# EasyEDA Pro project 自定义控制器主控.eprj

# Schematic Schematic1
Create Date: 2023-11-03; Page Name: P1; Project Name: 自定义控制器主控; Schematic Name: Schematic1; Update Date: 2023-11-04; Company: 嘉立创EDA; Page Size: A4; Version: V1.0
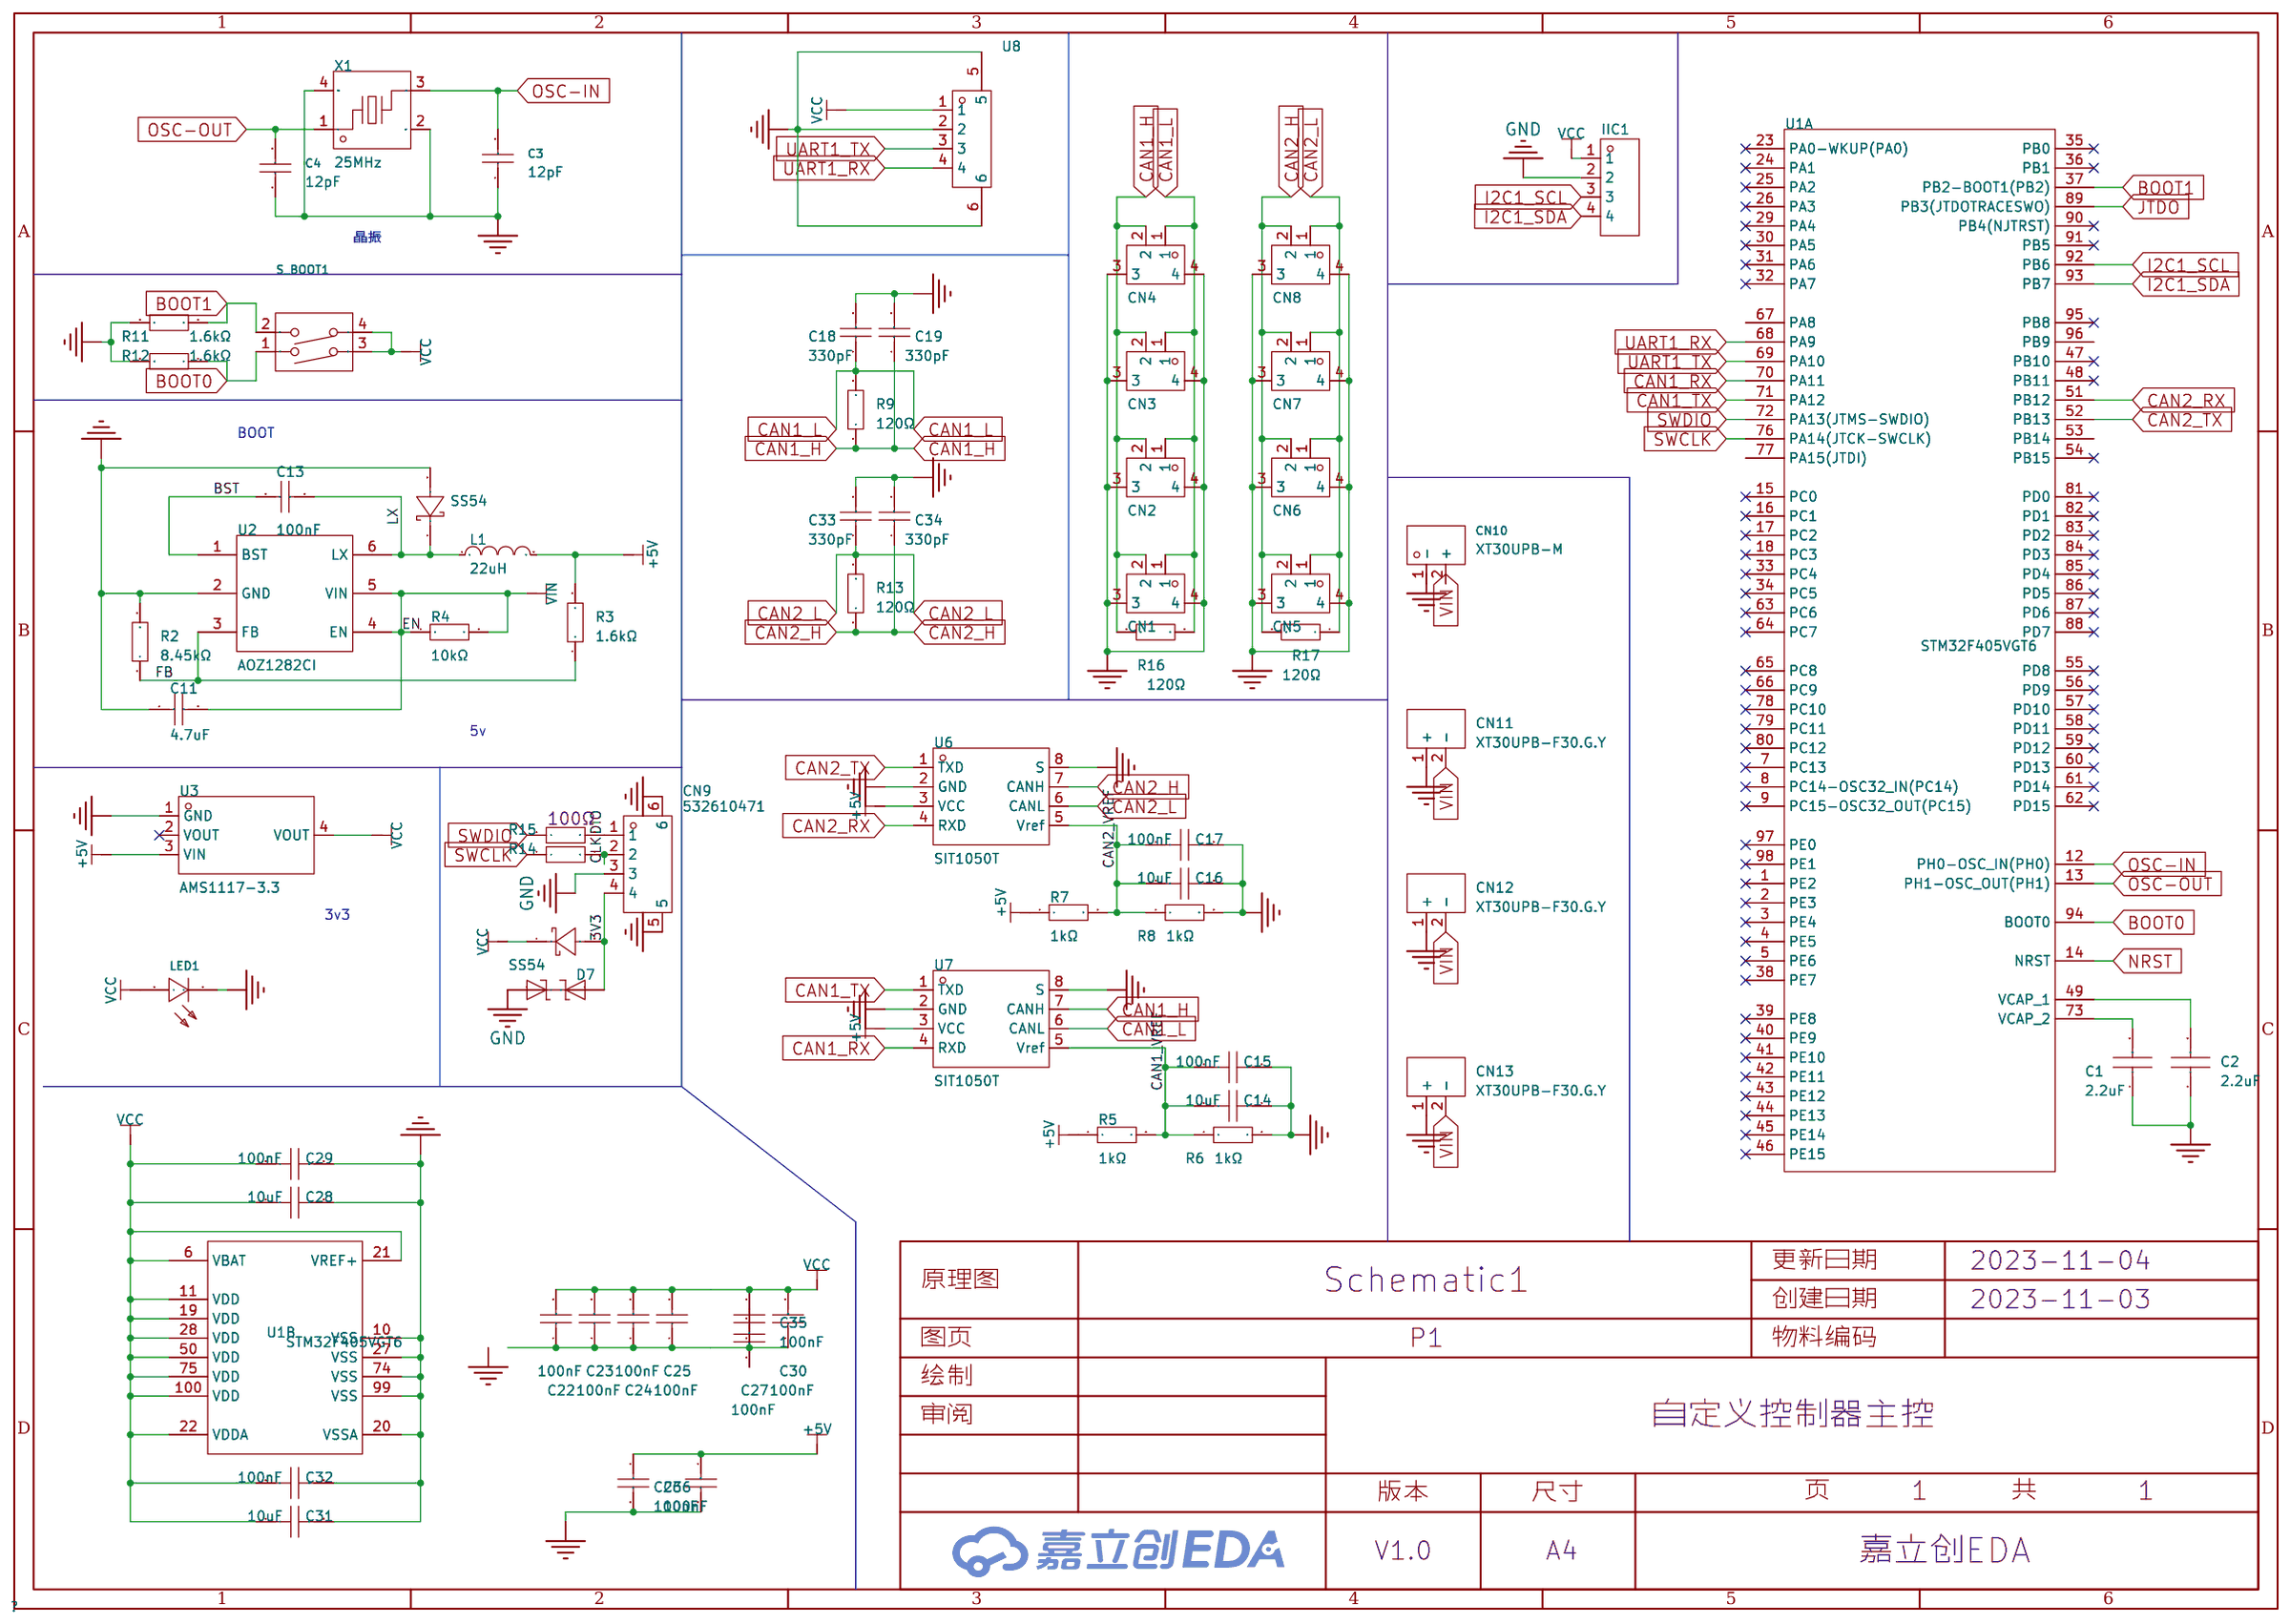
[diagram p0: schematic sheet]

## Parts
C1  2.2uF  [C0402]
C2  2.2uF  [C0402]
C3  12pF  [C0402]
C4  12pF  [C0402]
C11  4.7uF  [C1206]
C13  100nF  [C0603]
C14  10uF  [C0603]
C15  100nF  [C0402]
C16  10uF  [C0603]
C17  100nF  [C0402]
C18  330pF  [C0603]
C19  330pF  [C0603]
C22  100nF  [C0603]
C23  100nF  [C0603]
C24  100nF  [C0603]
C25  100nF  [C0603]
C26  100nF  [C0603]
C27  100nF  [C0603]
C28  10uF  [C0603]
C29  100nF  [C0402]
C30  100nF  [C0603]
C31  10uF  [C0603]
C32  100nF  [C0402]
C33  330pF  [C0603]
C34  330pF  [C0603]
C35  100nF  [C0603]
C36  100nF  [C0603]
CN1  GH1.25-2PWBPZ  [CONN-SMD_GH1.25-2PWBPZ]
CN2  GH1.25-2PWBPZ  [CONN-SMD_GH1.25-2PWBPZ]
CN3  GH1.25-2PWBPZ  [CONN-SMD_GH1.25-2PWBPZ]
CN4  GH1.25-2PWBPZ  [CONN-SMD_GH1.25-2PWBPZ]
CN5  GH1.25-2PWBPZ  [CONN-SMD_GH1.25-2PWBPZ]
CN6  GH1.25-2PWBPZ  [CONN-SMD_GH1.25-2PWBPZ]
CN7  GH1.25-2PWBPZ  [CONN-SMD_GH1.25-2PWBPZ]
CN8  GH1.25-2PWBPZ  [CONN-SMD_GH1.25-2PWBPZ]
CN9  532610471  [CONN-SMD_4P-P1.25_53261-0471]
CN10  XT30UPB-M  [CONN-TH_XT30UPB-M]
CN11  XT30UPB-F30.G.Y  [CONN-TH_XT30UPB-F]
CN12  XT30UPB-F30.G.Y  [CONN-TH_XT30UPB-F]
CN13  XT30UPB-F30.G.Y  [CONN-TH_XT30UPB-F]
D4  SS54  [SMA_L4.3-W2.6-LS5.0-RD]
D7  DW03D-B-S  [SOD-323_L1.7-W1.3-LS2.6-BI]
D8  SS54  [SMA_L4.3-W2.6-LS5.0-RD]
IIC1  2.54-1*4P母  [HDR-TH_4P-P2.54-V-F]
L1  22uH  [IND-SMD_L7.1-W6.6]
LED1  NCD0603R1  [LED0603-RD_RED]
R2  8.45kΩ  [R0603]
R3  1.6kΩ  [R0603]
R4  10kΩ  [R0603]
R5  1kΩ  [R0603]
R6  1kΩ  [R0603]
R7  1kΩ  [R0603]
R8  1kΩ  [R0603]
R9  120Ω  [R0603]
R11  1.6kΩ  [R0603]
R12  1.6kΩ  [R0603]
R13  120Ω  [R0603]
R14  0805W8F1000T5E  [R0805]
R15  0805W8F1000T5E  [R0805]
R16  120Ω  [R0603]
R17  120Ω  [R0603]
S_BOOT1  DSWB02LHGET  [SW-TH_DSWB02LHGET]
U1  STM32F405VGT6  [LQFP-100_L14.0-W14.0-P0.50-LS16.0-BL]  (sections 1,2)
U2  AOZ1282CI  [SOT-23-6_L2.9-W1.6-P0.95-LS2.8-BR]
U3  AMS1117-3.3  [SOT-223-3_L6.5-W3.4-P2.30-LS7.0-BR]
U6  SIT1050T  [SO-8_L4.9-W3.9-P1.27-LS5.9-BL]
U7  SIT1050T  [SO-8_L4.9-W3.9-P1.27-LS5.9-BL]
U8  GH1.25-4PWBPZ  [CONN-SMD_GH1.25-4PWBPZ]
X1  25MHz  [CRYSTAL-SMD_4P-L3.2-W2.5-BL]

## Library data of the parts
C1 C2 = CL05A225MQ5NSNC: 容值:2.2uF;精度:±20%;额定电压:6.3V;材质(温度系数):X5R;; LCSC Part Name: 2.2uF ±20% 6.3V; Supplier Part: C12530; Manufacturer: SAMSUNG(三星); Supplier Footprint: 0402; JLCPCB Part Class: 基础库; Datasheet: https://atta.szlcsc.com/upload/public/pdf/source/20160103/1457707666860.pdf; Supplier: LCSC; Tolerance: ±20%; Voltage Rated: 6.3V; Temperature Coefficient: X5R
C3 C4 = 0402CG120J500NT: 容值:12pF;精度:±5%;额定电压:50V;材质(温度系数):C0G;; LCSC Part Name: 12pF ±5% 50V; Supplier Part: C1547; Manufacturer: FH(风华); Supplier Footprint: 0402; JLCPCB Part Class: 基础库; Datasheet: https://atta.szlcsc.com/upload/public/pdf/source/20200305/C486355_26A10D38EF8C2A5C37091D0039909270.pdf; Supplier: LCSC; Tolerance: ±5%; Voltage Rated: 50V; Temperature Coefficient: C0G
C11 = 1206B475K500NT: 容值:4.7uF;精度:±10%;额定电压:50V;材质(温度系数):X7R;; LCSC Part Name: 4.7uF ±10% 50V; Supplier Part: C29823; Manufacturer: FH(风华); Supplier Footprint: 1206; JLCPCB Part Class: 基础库; Datasheet: https://atta.szlcsc.com/upload/public/pdf/source/20170923/C29823_1506149432461988716.pdf; Supplier: LCSC; Tolerance: ±10%; Voltage Rated: 50V; Temperature Coefficient: X7R
C13 C22-C27 C30 C35 C36 = 0603B104K500NT: 容值:100nF;精度:±10%;额定电压:50V;材质(温度系数):X7R;; LCSC Part Name: 100nF ±10% 50V; Supplier Part: C30926; Manufacturer: FH(风华); Supplier Footprint: 0603; JLCPCB Part Class: 扩展库; Datasheet: https://atta.szlcsc.com/upload/public/pdf/source/20170923/C30926_1506149436298988724.pdf; Supplier: LCSC; Tolerance: ±10%; Voltage Rated: 50V; Temperature Coefficient: X7R
C14 C16 C28 C31 = CL10A106KP8NNNC: 容值:10uF;精度:±10%;额定电压:10V;材质(温度系数):X5R;; LCSC Part Name: 10uF ±10% 10V; Supplier Part: C19702; Manufacturer: SAMSUNG(三星); Supplier Footprint: 0603; JLCPCB Part Class: 基础库; Datasheet: https://atta.szlcsc.com/upload/public/pdf/source/20160103/1457707703378.pdf; Supplier: LCSC; Tolerance: ±10%; Voltage Rated: 10V; Temperature Coefficient: X5R
C15 C17 C29 C32 = CC0402KRX7R7BB104: 容值:100nF;精度:±10%;额定电压:16V;材质(温度系数):X7R;; LCSC Part Name: 100nF ±10% 16V; Supplier Part: C60474; Manufacturer: YAGEO(国巨); Supplier Footprint: 0402; JLCPCB Part Class: 扩展库; Datasheet: https://atta.szlcsc.com/upload/public/pdf/source/20211223/9278FD768280B81DDBEF48FA36411A03.pdf; Supplier: LCSC; Tolerance: ±10%; Voltage Rated: 16V; Temperature Coefficient: X7R
C18 C19 C33 C34 = 0603B331K500NT: 容值:330pF;精度:±10%;额定电压:50V;材质(温度系数):X7R;; LCSC Part Name: 330pF ±10% 50V; Supplier Part: C1612; Manufacturer: FH(风华); Supplier Footprint: 0603; JLCPCB Part Class: 扩展库; Datasheet: https://atta.szlcsc.com/upload/public/pdf/source/20170923/C1612_1506149292351988411.pdf; Supplier: LCSC; Tolerance: ±10%; Voltage Rated: 50V; Temperature Coefficient: X7R
CN1-CN8 = GH1.25-2PWBPZ: LCSC Part Name: GH1.25-2P卧贴编带; Supplier Part: C2829251; Manufacturer: BOOMELE(博穆精密); JLCPCB Part Class: 扩展库; Datasheet: https://atta.szlcsc.com/upload/public/pdf/source/20211125/08A09A4909F58AF780B71FE423A00F7E.pdf; Supplier: LCSC
CN9 = 532610471: 参考系列:-;间距:1.25mm;插针结构:1x4P;排数:1;每排PIN数:4;行距:-;安装方式:-;触头材质:青铜;; LCSC Part Name: 间距:1.25mm 1x4P; Supplier Part: C240847; Manufacturer: MOLEX; Supplier Footprint: SMD,P=1.25mm; JLCPCB Part Class: 扩展库; Datasheet: https://atta.szlcsc.com/upload/public/pdf/source/20180801/C240848_05185111BCEC053393D7785380F62CFD.pdf; Supplier: LCSC; Pitch: 1.25mm; Pins Structure: 1x4P; Number of Rows: 1; Number of PINs Per Row: 4; Contact Material: 青铜
CN10 = XT30UPB-M: 类别:-;类型1:-;; LCSC Part Name: AMASS(艾迈斯)板载立式 航模锂电池控制器连接器插头 公头XT30UPB-M; Supplier Part: C428721; Manufacturer: AMASS(艾迈斯); JLCPCB Part Class: 扩展库; Datasheet: https://atta.szlcsc.com/upload/public/pdf/source/20230412/7B5DFEF57C9EA5273853390C734B3AC5.pdf; Supplier: LCSC; Brand: 艾迈斯; Type: 航模插头; Colour: 黄色; RatedVoltage: DC 500V; InterfaceType: 公头; MetalMaterial: 镀金; InsulationMaterial: PA; RatedCurrent: 15A; contact resistance: 0.65mΩ
CN11-CN13 = XT30UPB-F30.G.Y: 模型插头连接器; LCSC Part Name: AMASS(艾迈斯)直立焊板式连接器XT30UPB30-F.G.*; Supplier Part: C108769; Manufacturer: AMASS(艾迈斯); JLCPCB Part Class: 扩展库; Datasheet: https://atta.szlcsc.com/upload/public/pdf/source/20220715/AFD68B9E8B6CA95A7295DBF4AF9325E4.pdf; Supplier: LCSC
D4 D8 = SS54_C727065: 二极管配置:独立式;直流反向耐压(Vr):40V;平均整流电流(Io):5A;正向压降(Vf):550mV@5A;反向电流(Ir):500A@40V;; LCSC Part Name: 40V 5A 550mV@5A; Supplier Part: C727065; Manufacturer: TWGMC(台湾迪嘉); Supplier Footprint: SMA; JLCPCB Part Class: Extended Part; Datasheet: https://atta.szlcsc.com/upload/public/pdf/source/20200828/C727064_BD0A2B36CBC76CEA4B6710C57718D41F.pdf; Supplier: LCSC; Diode Configuration: 独立式; Reverse Voltage (Vr): 40V; Average Rectified Current (Io): 5A; Forward Voltage (Vf@If): 550mV@5A; Reverse Leakage Current (Ir): 500A@40V
D7 = DW03D-B-S: 极性:双向;反向截止电压(Vrwm):3.3V@Max;击穿电压(最小值):4V;击穿电压(最大值):-;反向漏电流(Ir):200nA;峰值脉冲电流(Ipp)@10/1000s:30A@8/20s;最大钳位电压:15V;峰值脉冲功率(Ppp)@10/1000s:450W@8/20s;; LCSC Part Name: 双向 Vrwm：3.3V@Max 450W@8/20s; Supplier Part: C2985478; Manufacturer: DOWO(东沃); Supplier Footprint: SOD-323; JLCPCB Part Class: Extended Part; Datasheet: https://atta.szlcsc.com/upload/public/pdf/source/20220323/2C0F61FEADD933F2ABF7337BEDBCF2BE.pdf; Supplier: LCSC; Polarity: 双向; Reverse Stand-Off Voltage (Vrwm): 3.3V@Max; Breakdown Voltage (Min): 4V; Reverse Leakage Current (Ir): 200nA; Peak Pulse Current (Ipp)@10/1000μs: 30A@8/20s; Maximum Clamping Voltage: 15V; Peak Pulse Power Dissipation (Ppp)@10/1000μs: 450W@8/20s
IIC1 = 2.54-1*4P母: 间距:2.54mm;总孔位数:4;排数:1;插孔结构:1x4P;行距:-;安装类型:直插;圆孔/方孔:方孔;额定电流:3A;额定电压:-;插孔方向:顶部;塑高:-;触头材质:青铜;触头镀层:-;工作温度范围:-40~+105;焊接温度(最大值):-;; LCSC Part Name: 2.54mm 1x4P; Supplier Part: C2718488; Manufacturer: BOOMELE(博穆精密); Supplier Footprint: 直插,P=2.54mm; JLCPCB Part Class: Extended Part; Datasheet: https://atta.szlcsc.com/upload/public/pdf/source/20210301/C2718488_F4427B881E42CAA8DDB0B1C12B3A522C.pdf; Supplier: LCSC; Pitch: 2.54mm; Number of Holes: 4; Number of Rows: 1; Holes Structure: 1x4P; Mounting Type: 直插; Circular Hole / Square Hole: 方孔; Current Rating (Max): 3A; Holes Direction: 顶部; Contact Material: 青铜; Operating Temperature Range: -40~+105
L1 = SLO0630H220MTT: 电感值:22uH;精度:±20%;额定电流:-;; LCSC Part Name: 22uH ±20%; Supplier Part: C207843; Manufacturer: Sunltech(韩国顺磁); Supplier Footprint: SMD; JLCPCB Part Class: 扩展库; Datasheet: https://atta.szlcsc.com/upload/public/pdf/source/20190925/C207843_2DF3589AE4B4D36C0A2894A292E80B76.pdf; Supplier: LCSC; Tolerance: ±20%
LED1 = NCD0603R1_C84263: 发光颜色:红灯;; LCSC Part Name: 红灯 0603红灯   正贴; Supplier Part: C84263; Manufacturer: 国星光电; Supplier Footprint: 0603; JLCPCB Part Class: 扩展库; Datasheet: https://atta.szlcsc.com/upload/public/pdf/source/20200820/C84263_DABC6A75E58F576973B407FDBA283D60.pdf; Supplier: LCSC; Emitted Color: 红灯
R2 = RMC06038.45K1%N: 阻值:8.45kΩ;精度:±1%;功率:100mW;; LCSC Part Name: 8.45kΩ ±1% 100mW; Supplier Part: C269431; Manufacturer: Tyohm(幸亚电阻); Supplier Footprint: 0603; JLCPCB Part Class: 扩展库; Datasheet: https://atta.szlcsc.com/upload/public/pdf/source/20190115/C269431_F17446403FF160758889B3EFAC3153F3.pdf; Supplier: LCSC; Tolerance: ±1%; Power(Watts): 100mW
R3 R11 R12 = 0603WAF1601T5E: 电阻类型:厚膜电阻;阻值:1.6kΩ;精度:±1%;功率:100mW;温度系数:±100ppm/℃;; LCSC Part Name: 厚膜电阻 1.6kΩ ±1% 100mW; Supplier Part: C22847; Manufacturer: UNI-ROYAL(厚声); Supplier Footprint: 0603; JLCPCB Part Class: Extended Part; Datasheet: https://atta.szlcsc.com/upload/public/pdf/source/20200306/C422600_1E6D84923E4A46A82E41ADD87F860B5C.pdf; Supplier: LCSC; Type: 厚膜电阻; Tolerance: ±1%; Power(Watts): 100mW; Temperature Coefficient: ±100ppm/℃; Overload Voltage (Max): 75V; Operating Temperature Range: -55℃~+155℃
R4 = 0603WAF1002T5E: 电阻类型:厚膜电阻;阻值:10kΩ;精度:±1%;功率:100mW;; LCSC Part Name: 厚膜电阻 10kΩ ±1% 100mW; Supplier Part: C25804; Manufacturer: UNI-ROYAL(厚声); Supplier Footprint: 0603; JLCPCB Part Class: Basic Part; Datasheet: https://atta.szlcsc.com/upload/public/pdf/source/20200306/C422600_1E6D84923E4A46A82E41ADD87F860B5C.pdf; Supplier: LCSC; Type: 厚膜电阻; Tolerance: ±1%; Power(Watts): 100mW; Temperature Coefficient: ±100ppm/℃; Overload Voltage (Max): 75V; Operating Temperature Range: -55℃~+155℃
R5-R8 = 0603WAF1001T5E: 电阻类型:厚膜电阻;阻值:1kΩ;精度:±1%;功率:100mW;温度系数:±100ppm/℃;; LCSC Part Name: 厚膜电阻 1kΩ ±1% 100mW; Supplier Part: C21190; Manufacturer: UNI-ROYAL(厚声); Supplier Footprint: 0603; JLCPCB Part Class: Basic Part; Datasheet: https://atta.szlcsc.com/upload/public/pdf/source/20200306/C422600_1E6D84923E4A46A82E41ADD87F860B5C.pdf; Supplier: LCSC; Type: 厚膜电阻; Tolerance: ±1%; Power(Watts): 100mW; Temperature Coefficient: ±100ppm/℃; Overload Voltage (Max): 75V; Operating Temperature Range: -55℃~+155℃
R9 R13 R16 R17 = 0603WAF1200T5E: 电阻类型:厚膜电阻;阻值:120Ω;精度:±1%;功率:100mW;温度系数:±100ppm/℃;; LCSC Part Name: 厚膜电阻 120Ω ±1% 100mW; Supplier Part: C22787; Manufacturer: UNI-ROYAL(厚声); Supplier Footprint: 0603; JLCPCB Part Class: Basic Part; Datasheet: https://atta.szlcsc.com/upload/public/pdf/source/20200306/C422600_1E6D84923E4A46A82E41ADD87F860B5C.pdf; Supplier: LCSC; Type: 厚膜电阻; Tolerance: ±1%; Power(Watts): 100mW; Temperature Coefficient: ±100ppm/℃; Overload Voltage (Max): 75V; Operating Temperature Range: -55℃~+155℃
R14 = 0805W8F1000T5E: LCSC Part Name: 100Ω(1000) ±1% 编带; Supplier Part: C17408; Manufacturer: UNI-ROYAL(厚声); Supplier Footprint: 0805; JLCPCB Part Class: Basic Part; Datasheet: https://atta.szlcsc.com/upload/public/pdf/source/20170920/C17408_1505887063818979767.pdf; Supplier: LCSC
R15 = 0805W8F1000T5E: LCSC Part Name: 100Ω; Supplier Part: C17408; Manufacturer: UNI-ROYAL(厚声); Supplier Footprint: 0805; JLCPCB Part Class: Basic Part; Datasheet: https://atta.szlcsc.com/upload/public/pdf/source/20170920/C17408_1505887063818979767.pdf; Supplier: LCSC
S_BOOT1 = DSWB02LHGET: 类型:平拨,凸起式;电路结构:单刀单掷;开关位数:2;使用寿命:-;颜色:红色;; LCSC Part Name: 拨码开关,平拨开关,DSWB02LHGET; Supplier Part: C99421; Manufacturer: YE; Supplier Footprint: 插件; JLCPCB Part Class: 扩展库; Datasheet: https://atta.szlcsc.com/upload/public/pdf/source/20170330/1490854270511.pdf; Supplier: LCSC; Type: 平拨,凸起式; Circuit: 单刀单掷; Number of Positions: 2; Lead Pitch: 2.54mm; Color: 红色
U1 = STM32F405VGT6: CPU内核:ARM Cortex-M4;CPU最大主频:168MHz;工作电压范围:1.8V~3.6V;程序存储容量:1MB;程序存储器类型:FLASH;RAM总容量:192KB;GPIO端口数量:82;; Supplier Part: C56621; Manufacturer: ST(意法半导体); Supplier Footprint: LQFP-100(14x14); JLCPCB Part Class: 扩展库; Datasheet: https://atta.szlcsc.com/upload/public/pdf/source/20150910/1457707351424.pdf; Supplier: LCSC; CPU Core: ARM Cortex-M4; CPU Maximum Speed: 168MHz; Operating Voltage Range: 1.8V~3.6V; Program Storage Size: 1MB; Program Memory Type: FLASH; RAM Size: 192KB; GPIO Ports Number: 82; ADC (Bit): 12bit; DAC (Bit): 12bit; Universal Serial Bus: 有; Peripheral/Function: DMA；LCD/LED驱动；PWM; Watchdog: 有; Infrared Data Association: 有; Low-Voltage Detect: 有; LCD Module: 有; Direct Memory Access: 有; Internal Oscillator: 有; Operating Temperature Range: -40℃~+85℃
U2 = AOZ1282CI: 功能类型:降压型;输出类型:可调;输入电压:4.5V~36V;输出电压:800mV~36V;输出电流(最大值):1.2A;; LCSC Part Name: 降压型 输入4.5V~36V 输出800mV~36V 1.2A; Supplier Part: C111916; Manufacturer: AOS; Supplier Footprint: SOT-23-6; JLCPCB Part Class: 扩展库; Datasheet: https://atta.szlcsc.com/upload/public/pdf/source/20170620/1497944735320.pdf; Supplier: LCSC; Function: 降压型; Synchronous Rectification: 否; Output Type: 可调; Number of Outputs: 1; Topology: 降压式; Input Voltage: 4.5V~36V; Output Voltage: 800mV~36V; Output Current (Max): 1.2A; Switching Frequency: 450kHz; Operating Temperature: -40℃~+85℃@(TA)
U3 = AMS1117-3.3_C6186: 输出类型:固定;输出极性:正;最大输入电压:-;输出电压:3.3V;输出电流:1A;电源纹波抑制比(PSRR):72dB@(120Hz);; LCSC Part Name: 输出3.3V 1A; Supplier Part: C6186; Manufacturer: AMS; Supplier Footprint: SOT-223; JLCPCB Part Class: 基础库; Datasheet: https://atta.szlcsc.com/upload/public/pdf/source/20180727/C6186_7A095716F0823C02F1997A905E26C086.pdf; Supplier: LCSC; Output Type: 固定; Output Polarity: 正; Number of Outputs: 1; Output Voltage: 3.3V; Dropout Voltage: 1.3V@(800mA); Output Current: 1A; Power Supply Rejection Ratio (PSRR): 72dB@(120Hz)
U6 U7 = SIT1050T: 类型:收发器;数据速率:1Mbps;; Supplier Part: C313021; Manufacturer: SIT(芯力特); Supplier Footprint: SO-8; JLCPCB Part Class: 扩展库; Datasheet: https://atta.szlcsc.com/upload/public/pdf/source/20190522/C313021_F295A63AE262020D1D58DBA99C3629E3.pdf; Supplier: LCSC; Type: 收发器; Data Rate: 1Mbps; Supply Voltage: 4.5V~5.5V
U8 = GH1.25-4PWBPZ: LCSC Part Name: GH1.25-4P卧贴编带; Supplier Part: C2829253; Manufacturer: BOOMELE(博穆精密); JLCPCB Part Class: 扩展库; Datasheet: https://atta.szlcsc.com/upload/public/pdf/source/20211125/08A09A4909F58AF780B71FE423A00F7E.pdf; Supplier: LCSC
X1 = XL2EL89CSI-111YLC-25M: 频率:25MHz;频率公差:±10ppm;负载电容:20pF;; LCSC Part Name: 25MHz ±10ppm 20pF YSX321SL; Supplier Part: C5280577; Manufacturer: YXC(扬兴晶振); Supplier Footprint: SMD3225-4P; JLCPCB Part Class: 扩展库; Datasheet: https://atta.szlcsc.com/upload/public/pdf/source/20221123/8DAA01809C4E3F159850A71277C18D74.pdf; Supplier: LCSC; Crystal Type: 贴片无源晶振; Frequency Tolerance: ±10ppm; Load Capacitance: 20pF

## Nets
3V3: CN9.4 D4.2 D7.2(A)
+5V: C26.1 C36.1 L1.2 R3.2 R5.1 R7.1 U3.3(VIN) U6.3(VCC) U7.3(VCC)
GND: C1.1 C2.1 C3.1 C4.1 C11.1 C14.2 C15.2 C16.2 C17.2 C18.2 C19.2 C22.1 C23.1 C24.1 C25.1 C26.2 C27.1 C28.2 C29.2 C30.1 C31.2 C32.2 C33.2 C34.2 C35.2 C36.2 CN1.3 CN1.4 CN2.3 CN2.4 CN3.3 CN3.4 CN4.3 CN4.4 CN5.3 CN5.4 CN6.3 CN6.4 CN7.3 CN7.4 CN8.3 CN8.4 CN9.3 CN9.5 CN9.6 CN10.1(-) CN11.1(+) CN12.1(+) CN13.1(+) D7.1(K) D8.2 IIC1.2 LED1.1(K) R2.2 R6.2 R8.2 R11.2 R12.2 U1.10(VSS) U1.20(VSSA) U1.27(VSS) U1.74(VSS) U1.99(VSS) U2.2(GND) U3.1(GND) U6.2(GND) U6.8(S) U7.2(GND) U7.8(S) U8.2 U8.5 U8.6 X1.2(GND) X1.4(GND)
VCC: C22.2 C23.2 C24.2 C25.2 C27.2 C28.1 C29.1 C30.2 C31.1 C32.1 C35.1 D4.1 IIC1.1 LED1.2(A) S_BOOT1.3 S_BOOT1.4 U1.6(VBAT) U1.11(VDD) U1.19(VDD) U1.21(VREF+) U1.22(VDDA) U1.28(VDD) U1.50(VDD) U1.75(VDD) U1.100(VDD) U3.4(VOUT) U8.1
VIN: C11.2 CN10.2(+) CN11.2(-) CN12.2(-) CN13.2(-) R4.2 U2.5(VIN)
BOOT0: R12.1 S_BOOT1.1 U1.94(BOOT0)
BOOT1: R11.1 S_BOOT1.2 U1.37(PB2-BOOT1(PB2))
BST: C13.1 U2.1(BST)
CAN1_H: C19.1 CN1.2 CN2.2 CN3.2 CN4.2 R9.1 R16.2 U7.7(CANH)
CAN1_L: C18.1 CN1.1 CN2.1 CN3.1 CN4.1 R9.2 R16.1 U7.6(CANL)
CAN1_RX: U1.70(PA11) U7.4(RXD)
CAN1_TX: U1.71(PA12) U7.1(TXD)
CAN1_VREF: C14.1 C15.1 R5.2 R6.1 U7.5(Vref)
CAN2_H: C34.1 CN5.2 CN6.2 CN7.2 CN8.2 R13.1 R17.2 U6.7(CANH)
CAN2_L: C33.1 CN5.1 CN6.1 CN7.1 CN8.1 R13.2 R17.1 U6.6(CANL)
CAN2_RX: U1.51(PB12) U6.4(RXD)
CAN2_TX: U1.52(PB13) U6.1(TXD)
CAN2_VREF: C16.1 C17.1 R7.2 R8.1 U6.5(Vref)
CLK: CN9.2 R14.2
DIO: CN9.1 R15.2
EN: R4.1 U2.4(EN)
FB: R2.1 R3.1 U2.3(FB)
I2C1_SCL: IIC1.3 U1.92(PB6)
I2C1_SDA: IIC1.4 U1.93(PB7)
JTDO: U1.89(PB3(JTDOTRACESWO))
LX: C13.2 D8.1 L1.1 U2.6(LX)
NRST: U1.14(NRST)
OSC-IN: C3.2 U1.12(PH0-OSC_IN(PH0)) X1.3
OSC-OUT: C4.2 U1.13(PH1-OSC_OUT(PH1)) X1.1
SWCLK: R14.1 U1.76(PA14(JTCK-SWCLK))
SWDIO: R15.1 U1.72(PA13(JTMS-SWDIO))
UART1_RX: U1.68(PA9) U8.4
UART1_TX: U1.69(PA10) U8.3
VCAP_1: C2.2 U1.49(VCAP_1)
VCAP_2: C1.2 U1.73(VCAP_2)

Not connected (* = marked no-connect by the designer): U1 1(PE2)* 2(PE3)* 3(PE4)* 4(PE5)* 5(PE6)* 7(PC13)* 8(PC14-OSC32_IN(PC14))* 9(PC15-OSC32_OUT(PC15))* 15(PC0)* 16(PC1)* 17(PC2)* 18(PC3)* 23(PA0-WKUP(PA0))* 24(PA1)* 25(PA2)* 26(PA3)* 29(PA4)* 30(PA5)* 31(PA6)* 32(PA7)* 33(PC4)* 34(PC5)* 35(PB0)* 36(PB1)* 38(PE7)* 39(PE8)* 40(PE9)* 41(PE10)* 42(PE11)* 43(PE12)* 44(PE13)* 45(PE14)* 46(PE15)* 47(PB10)* 48(PB11)* 53(PB14) 54(PB15)* 55(PD8)* 56(PD9)* 57(PD10)* 58(PD11)* 59(PD12)* 60(PD13)* 61(PD14)* 62(PD15)* 63(PC6)* 64(PC7)* 65(PC8)* 66(PC9)* 67(PA8) 77(PA15(JTDI)) 78(PC10)* 79(PC11)* 80(PC12)* 81(PD0)* 82(PD1)* 83(PD2)* 84(PD3)* 85(PD4)* 86(PD5)* 87(PD6)* 88(PD7)* 90(PB4(NJTRST))* 91(PB5)* 95(PB8)* 96(PB9) 97(PE0)* 98(PE1)*; U3 2(VOUT)*

## Notes on the sheet
- 晶振
- BOOT
- 5v
- 3v3

# Board PCB1
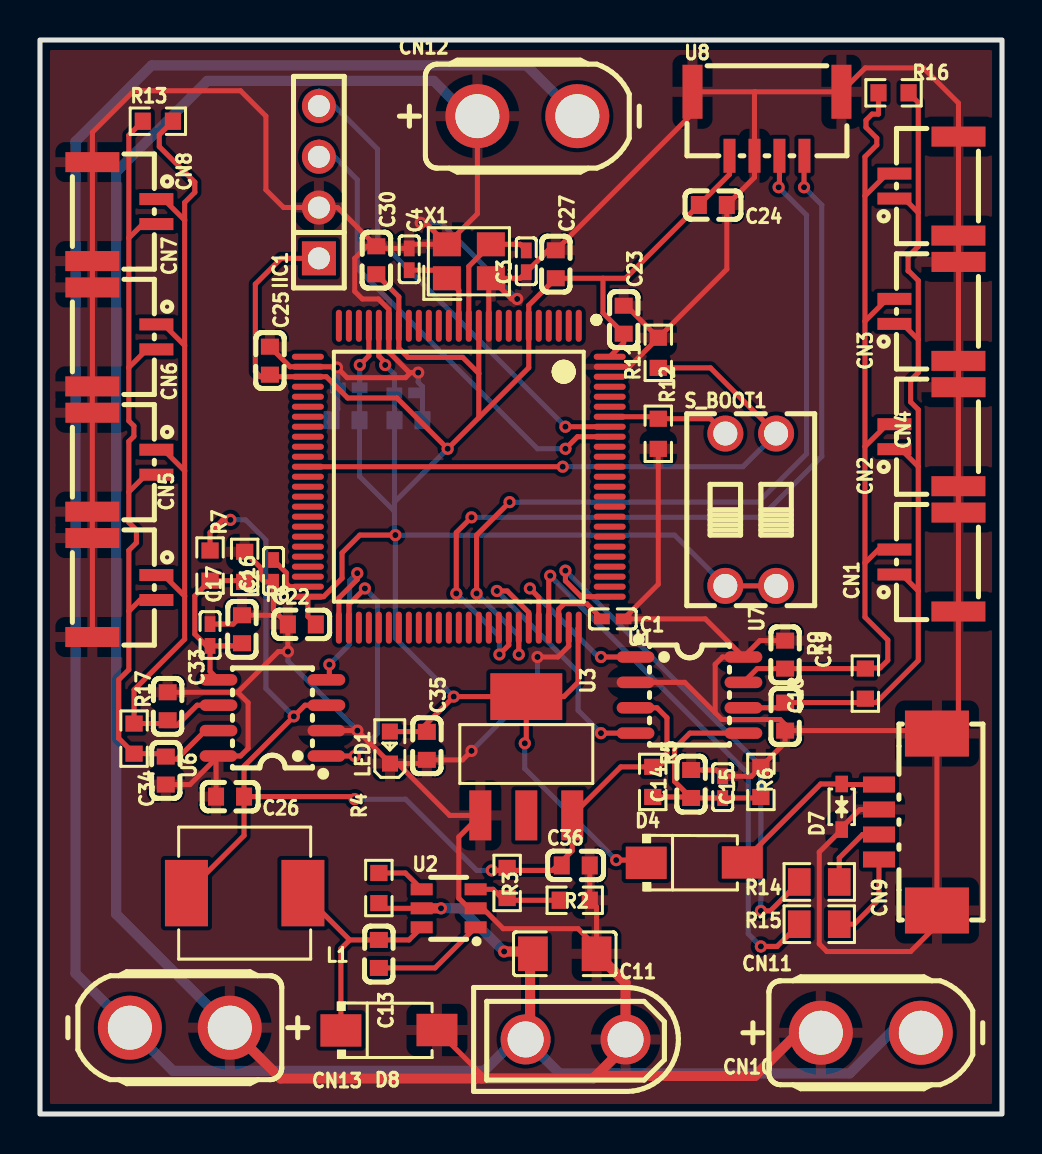
[diagram p1: board, top side]
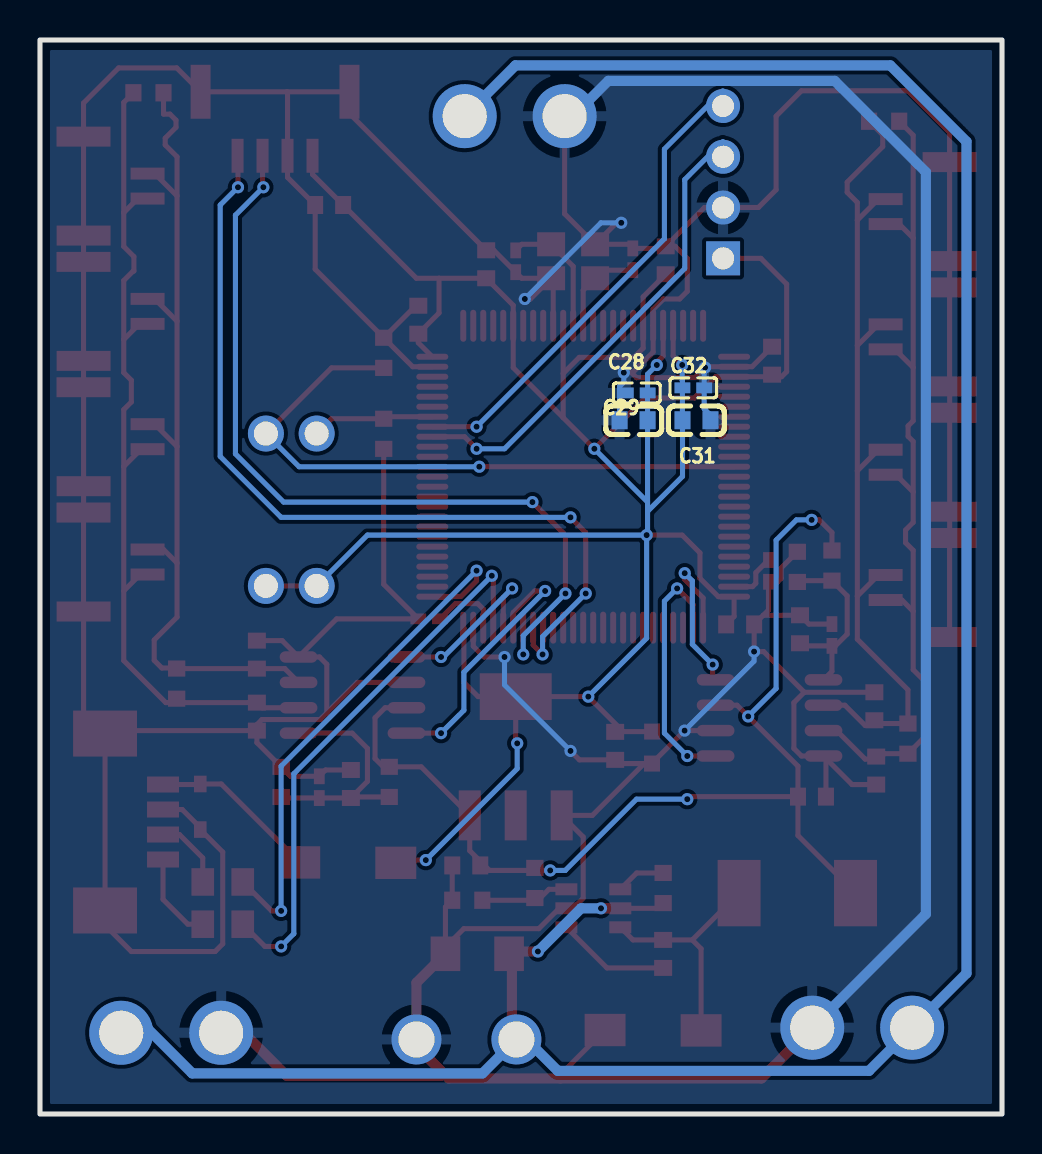
[diagram p2: board, bottom side, seen from below]

Outline 48.13 x 53.72 mm; copper layers: Top Layer, Bottom Layer. Coordinates in mm from the lower left corner of the outline.
Outline path: rectangle 0,53.72 48.13,0
Stack: Top Layer 0.035mm / Dielectric1 1.51mm FR4 er 4.5 / Bottom Layer 0.035mm

## Design rules (mm)
net CAN2_H: DP2
net CAN2_L: DP2
net CAN1_H: DP1
net CAN1_L: DP1
template: JLCPCB Capability(Two Layers Board)
spacing copperThickness1oz (default): track to track 0.102, other pairs 0.152 to 0.3
spacing copperThickness2oz: track to track 0.203, other pairs 0.152 to 0.3
track width copperThickness1oz (default): min 0.127, default 0.254, max 2.54
track width copperThickness2oz: min 0.203, default 0.254, max 2.54
differential pair differentialPair (default): width min 0.127, default 0.254, max 2.54; gap min 0.152, default 0.152
via viaSize (default): diameter min 0.5, default 0.61, max 10; hole min 0.3, default 0.305, max 6.3

## Placement (name value [footprint] x y rotation side)
C1  2.2uF  [C0402]  28.66 24.76 180 top
C2  2.2uF  [C0402]  11.68 27.17 90 top
C3  12pF  [C0402]  24.33 42.65 90 top
C4  12pF  [C0402]  18.47 42.75 270 top
C11  4.7uF  [C1206]  26.25 8.01 180 top
C13  100nF  [C0603]  16.96 8.01 90 top
C14  10uF  [C0603]  32.58 16.51 90 top
C15  100nF  [C0402]  34.16 16.35 90 top
C16  10uF  [C0603]  10.11 24.25 90 top
C17  100nF  [C0402]  8.51 23.96 90 top
C18  330pF  [C0603]  37.28 19.88 270 top
C19  330pF  [C0603]  37.28 22.98 90 top
C22  100nF  [C0603]  13.1 24.49 0 top
C23  100nF  [C0603]  29.2 39.73 270 top
C24  100nF  [C0603]  33.66 45.47 180 top
C25  100nF  [C0603]  11.5 37.68 270 top
C26  100nF  [C0603]  9.51 15.87 180 top
C27  100nF  [C0603]  25.81 42.5 270 top
C28  10uF  [C0603]  18.44 34.7 0 bottom
C29  100nF  [C0402]  18.28 36.07 0 bottom
C30  100nF  [C0603]  16.83 42.7 270 top
C31  10uF  [C0603]  15.29 34.7 180 bottom
C32  100nF  [C0402]  15.45 36.32 180 bottom
C33  330pF  [C0603]  6.39 20.4 90 top
C34  330pF  [C0603]  6.29 17.18 270 top
C35  100nF  [C0603]  19.35 18.41 270 top
C36  100nF  [C0603]  26.81 12.43 0 top
CN1  GH1.25-2PWBPZ  [CONN-SMD_GH1.25-2PWBPZ]  44.35 27.61 90 top
CN2  GH1.25-2PWBPZ  [CONN-SMD_GH1.25-2PWBPZ]  44.35 33.88 90 top
CN3  GH1.25-2PWBPZ  [CONN-SMD_GH1.25-2PWBPZ]  44.35 40.15 90 top
CN4  GH1.25-2PWBPZ  [CONN-SMD_GH1.25-2PWBPZ]  44.35 46.41 90 top
CN5  GH1.25-2PWBPZ  [CONN-SMD_GH1.25-2PWBPZ]  4.22 26.33 270 top
CN6  GH1.25-2PWBPZ  [CONN-SMD_GH1.25-2PWBPZ]  4.22 32.6 270 top
CN7  GH1.25-2PWBPZ  [CONN-SMD_GH1.25-2PWBPZ]  4.22 38.87 270 top
CN8  GH1.25-2PWBPZ  [CONN-SMD_GH1.25-2PWBPZ]  4.22 45.14 270 top
CN9  532610471  [CONN-SMD_4P-P1.25_53261-0471]  43.43 14.6 90 top
CN10  XT30UPB-M  [CONN-TH_XT30UPB-M]  26.8 3.73 180 top
CN11  XT30UPB-F30.G.Y  [CONN-TH_XT30UPB-F]  41.57 4.06 0 top
CN12  XT30UPB-F30.G.Y  [CONN-TH_XT30UPB-F]  24.38 49.91 0 top
CN13  XT30UPB-F30.G.Y  [CONN-TH_XT30UPB-F]  7 4.32 180 top
D4  SS54  [SMA_L4.3-W2.6-LS5.0-RD]  32.73 12.57 0 top
D7  DW03D-B-S  [SOD-323_L1.7-W1.3-LS2.6-BI]  40.11 15.37 90 top
D8  SS54  [SMA_L4.3-W2.6-LS5.0-RD]  17.46 4.19 0 top
IIC1  2.54-1*4P母  [HDR-TH_4P-P2.54-V-F]  13.96 46.61 90 top
L1  22uH  [IND-SMD_L7.1-W6.6]  10.24 11.05 180 top
LED1  NCD0603R1  [LED0603-RD_RED]  17.51 18.33 90 top
R2  8.45kΩ  [R0603]  26.75 10.69 0 top
R3  1.6kΩ  [R0603]  23.37 11.56 90 top
R4  10kΩ  [R0603]  16.96 11.3 270 top
R5  1kΩ  [R0603]  30.66 16.61 270 top
R6  1kΩ  [R0603]  36.07 16.61 90 top
R7  1kΩ  [R0603]  8.51 27.43 270 top
R8  1kΩ  [R0603]  10.24 27.37 90 top
R9  120Ω  [R0603]  41.29 21.53 270 top
R11  1.6kΩ  [R0603]  30.94 38.07 90 top
R12  1.6kΩ  [R0603]  30.94 34.02 270 top
R13  120Ω  [R0603]  5.9 49.66 0 top
R14  0805W8F1000T5E  [R0805]  38.99 11.61 0 top
R15  0805W8F1000T5E  [R0805]  38.99 9.49 0 top
R16  120Ω  [R0603]  42.71 51.08 180 top
R17  120Ω  [R0603]  4.71 18.78 270 top
S_BOOT1  DSWB02LHGET  [SW-TH_DSWB02LHGET]  35.56 30.23 0 top
U1  STM32F405VGT6  [LQFP-100_L14.0-W14.0-P0.50-LS16.0-BL]  20.96 31.88 180 top
U2  AOZ1282CI  [SOT-23-6_L2.9-W1.6-P0.95-LS2.8-BR]  20.45 10.29 0 top
U3  AMS1117-3.3  [SOT-223-3_L6.5-W3.4-P2.30-LS7.0-BR]  24.33 17.91 270 top
U6  SIT1050T  [SO-8_L4.9-W3.9-P1.27-LS5.9-BL]  11.63 19.81 90 top
U7  SIT1050T  [SO-8_L4.9-W3.9-P1.27-LS5.9-BL]  32.5 20.95 270 top
U8  GH1.25-4PWBPZ  [CONN-SMD_GH1.25-4PWBPZ]  36.37 49.53 0 top
X1  25MHz  [CRYSTAL-SMD_4P-L3.2-W2.5-BL]  21.46 42.65 0 top

## Footprints (pads in the part's own frame, mm; a bottom-side part is the same pattern mirrored in y, then rotated)
C0402
  rect 0.79x0.54 smd: 1(-0.545,0) 2(0.545,0)
C0603
  rect 0.8x0.9 smd: 1(-0.7,0) 2(0.7,0)
C1206
  rect 1.485x1.728 smd: 1(-1.593,0) 2(1.593,0)
CONN-SMD_4P-P1.25_53261-0471
  rect 0.8x1.6 smd: 1(-1.875,1.45) 2(-0.625,1.45) 3(0.625,1.45) 4(1.875,1.45)
  rect 2.3x3.2 smd: 5(4.425,-1.45) 6(-4.425,-1.45)
CONN-SMD_GH1.25-2PWBPZ
  rect 0.6x1.7 smd: 1(-0.625,1.602) 2(0.625,1.602)
  rect 1x2.7 smd: 3(2.475,-1.602) 4(-2.475,-1.598)
CONN-SMD_GH1.25-4PWBPZ
  rect 0.6x1.7 smd: 1(-1.875,-1.601) 2(-0.625,-1.601) 3(0.625,-1.601) 4(1.875,-1.601)
  rect 1x2.7 smd: 5(-3.725,1.601) 6(3.725,1.601)
CONN-TH_XT30UPB-F
  round 3.2 hole 2.2: 1(-2.5,0) 2(2.5,0)
CONN-TH_XT30UPB-M
  round 2.5 hole 1.8: 1(-2.5,0) 2(2.5,0)
CRYSTAL-SMD_4P-L3.2-W2.5-BL
  rect 1.4x1.2 smd: 1(-1.1,-0.85) 2(1.1,-0.85) 3(1.1,0.85) 4(-1.1,0.85)
HDR-TH_4P-P2.54-V-F
  rect 1.7x1.7 hole 1.1: 1(-3.81,0)
  round 1.7 hole 1.1: 2(-1.27,0) 3(1.27,0) 4(3.81,0)
IND-SMD_L7.1-W6.6
  rect 2.15x3.32 smd: 1(-2.913,0) 2(2.913,0)
LED0603-RD_RED
  rect 0.8x0.8 smd: 1(-0.799,-0.004) 2(0.799,0.004)
LQFP-100_L14.0-W14.0-P0.50-LS16.0-BL
  oval 0.3x1.6 smd: 1(-6,-7.55) 2(-5.5,-7.55) 3(-5,-7.55) 4(-4.5,-7.55) 5(-4,-7.55) 6(-3.5,-7.55) 7(-3,-7.55) 8(-2.5,-7.55) 9(-2,-7.55) 10(-1.5,-7.55) 11(-1,-7.55) 12(-0.5,-7.55) 13(0,-7.55) 14(0.5,-7.55) 15(1,-7.55) 16(1.5,-7.55) 17(2,-7.55) 18(2.5,-7.55) 19(3,-7.55) 20(3.5,-7.55) 21(4,-7.55) 22(4.5,-7.55) 23(5,-7.55) 24(5.5,-7.55) 25(6,-7.55) 51(6,7.55) 52(5.5,7.55) 53(5,7.55) 54(4.5,7.55) 55(4,7.55) 56(3.5,7.55) 57(3,7.55) 58(2.5,7.55) 59(2,7.55) 60(1.5,7.55) 61(1,7.55) 62(0.5,7.55) 63(0,7.55) 64(-0.5,7.55) 65(-1,7.55) 66(-1.5,7.55) 67(-2,7.55) 68(-2.5,7.55) 69(-3,7.55) 70(-3.5,7.55) 71(-4,7.55) 72(-4.5,7.55) 73(-5,7.55) 74(-5.5,7.55) 75(-6,7.55)
  oval 1.6x0.3 smd: 26(7.55,-6) 27(7.55,-5.5) 28(7.55,-5) 29(7.55,-4.5) 30(7.55,-4) 31(7.55,-3.5) 32(7.55,-3) 33(7.55,-2.5) 34(7.55,-2) 35(7.55,-1.5) 36(7.55,-1) 37(7.55,-0.5) 38(7.55,0) 39(7.55,0.5) 40(7.55,1) 41(7.55,1.5) 42(7.55,2) 43(7.55,2.5) 44(7.55,3) 45(7.55,3.5) 46(7.55,4) 47(7.55,4.5) 48(7.55,5) 49(7.55,5.5) 50(7.55,6) 76(-7.55,6) 77(-7.55,5.5) 78(-7.55,5) 79(-7.55,4.5) 80(-7.55,4) 81(-7.55,3.5) 82(-7.55,3) 83(-7.55,2.5) 84(-7.55,2) 85(-7.55,1.5) 86(-7.55,1) 87(-7.55,0.5) 88(-7.55,0) 89(-7.55,-0.5) 90(-7.55,-1) 91(-7.55,-1.5) 92(-7.55,-2) 93(-7.55,-2.5) 94(-7.55,-3) 95(-7.55,-3.5) 96(-7.55,-4) 97(-7.55,-4.5) 98(-7.55,-5) 99(-7.55,-5.5) 100(-7.55,-6)
R0603
  rect 0.806x0.864 smd: 1(-0.753,0) 2(0.753,0)
R0805
  rect 1.133x1.377 smd: 1(-1,0) 2(1,0)
SMA_L4.3-W2.6-LS5.0-RD
  rect 2.047x1.621 smd: 1(-2.403,-0.01) 2(2.403,0.01)
SO-8_L4.9-W3.9-P1.27-LS5.9-BL
  oval 0.574x1.888 smd: 1(-1.905,-2.699) 2(-0.635,-2.699) 3(0.635,-2.699) 4(1.905,-2.699) 5(1.905,2.699) 6(0.635,2.699) 7(-0.635,2.699) 8(-1.905,2.699)
SOD-323_L1.7-W1.3-LS2.6-BI
  rect 0.831x0.63 smd: 1(-1.141,0) 2(1.141,0)
SOT-23-6_L2.9-W1.6-P0.95-LS2.8-BR
  rect 1.1x0.6 smd: 1(1.35,-0.95) 2(1.35,0) 3(1.35,0.95) 4(-1.35,0.95) 5(-1.35,0) 6(-1.35,-0.95)
SOT-223-3_L6.5-W3.4-P2.30-LS7.0-BR
  rect 2.5x1.1 smd: 1(2.97,-2.3) 2(2.97,0) 3(2.97,2.3)
  rect 2.34x3.6 smd: 4(-2.97,0)
SW-TH_DSWB02LHGET
  round 1.8 hole 1.2: 1(-1.27,3.81) 2(1.27,3.81) 3(-1.27,-3.81) 4(1.27,-3.81)

## Nets
As in the schematic.

Pads without a net: U1 1 2 3 4 5 7 8 9 15 16 17 18 23 24 25 26 29 30 31 32 33 34 35 36 38 39 40 41 42 43 44 45 46 47 48 53 54 55 56 57 58 59 60 61 62 63 64 65 66 67 77 78 79 80 81 82 83 84 85 86 87 88 90 91 95 96 97 98; U3 2

## Via types
v1: diameter 0.61, hole 0.305, Top Layer to Bottom Layer, 44 vias

## Routing (per net, layer and track width the routed paths; a pad name or vN(x,y) marks a point on that pad's centre or on a via; arc(x,y) is an arc through that point)
3V3: length 8.5
  Top Layer w0.254: D4.2 39.06,16.51 D7.2 40.14,16.48 CN9.4
+5V: length 56.6
  Top Layer w0.254: v1(15.75,15.75) 15.62,15.87 C26.1 ; L1.2 10.21,13.93 C26.1 ; C26.1 10.21,17.4 v1(12.7,19.89) 13.26,20.45 U6.3 ; v1(22.61,12.18) 25.65,12.18 26.63,13.17 U3.3 29.06,17.36 R5.1 30.95,17.36 31.37,17.78 31.37,19.82 30.87,20.32 29.8,20.32 ; v1(9.53,29.72) 9.14,29.72 8.51,29.08 R7.1
  Bottom Layer w0.254: v1(9.53,29.72) 10.29,29.72 11.3,28.7 11.3,21.28 v1(12.7,19.89) ; v1(15.75,15.75) 18.29,15.75 21.85,12.18 v1(22.61,12.18)
GND: length 420.3
  Top Layer w0.254: C18.2 37.28,18.58 R6.2 35.6,16.89 C15.2 33.84,17.21 C14.2 ; C18.2 44.73,19.18 CN9.5 ; C18.2 37.28,19.48 37.03,19.73 34.12,19.73 33.78,20.07 ; D8.2 22.1,1.96 22.1,1.78 ; 11.94,24.95 C22.1 12.4,23.13 v1(12.41,23.13) 11.93,23.13 9.89,21.1 ; 11.94,24.95 C16.2 9.66,24.5 C17.2 ; 11.94,24.95 11.68,25.21 C2.1 11.22,26.62 11.05,26.8 11.05,27.31 R8.2 ; X1.2 23.59,40.77 v1(23.88,40.77) ; X1.2 22.46,41.7 U1.10 ; X1.2 24.03,41.8 C3.1 25.43,43.2 C27.1 32.65,50.04 U8.5 35.77,51.13 ; C34.2 7.5,16.48 8.81,17.78 ; 9.89,21.1 10.41,20.57 10.41,18.29 10.03,17.91 U6.8 8.81,17.78 ; 9.89,21.1 C33.2 ; C19.2 36.01,23.68 U7.8 ; U1.74 26.46,23.4 25.91,22.86 v1(24.89,22.86) ; C23.1 29.33,40.43 R11.2 ; 18.54,37.08 18.48,37.08 17.46,38.11 U1.20 17.46,40.25 16.93,40.77 16.13,40.77 15.75,41.15 15.75,42.8 16.35,43.4 16.83,43.4 ; 18.54,37.08 v1(18.92,37.08) ; 18.54,37.08 18.29,36.83 15.37,36.83 v1(14.86,37.34) 14.82,37.38 U1.27 12.51,37.38 C25.1 ; 35.77,51.13 U8.6 41.29,52.32 44.2,52.32 45.95,50.57 CN4.3 45.95,43.94 CN4.4 45.95,43.93 CN3.3 45.95,37.67 CN3.4 45.95,37.67 CN2.3 45.95,36.35 CN2.4 45.95,30.09 CN1.3 45.95,25.14 CN1.4 45.95,20.1 CN9.5 ; 35.77,51.13 35.75,51.1 U8.2 35.75,46.85 C24.1 34.36,42.26 R11.2 ; U7.2 32.26,21.59 33.78,20.07 ; v1(19.05,44.58) 19.28,44.58 X1.4 ; 17.9,17.53 LED1.1 ; 17.9,17.53 19.17,17.53 C35.2 21.14,17.71 v1(21.59,18.16) ; 17.9,17.53 20.5,14.94 U3.1 20.96,13.86 20.96,10.79 21.46,10.29 U2.2 22.16,10.29 23.17,9.27 26.92,9.27 27.85,8.35 ; 27.85,8.35 27.85,10.35 R2.2 27.51,12.24 27.32,12.43 ; 27.85,8.35 C11.1 ; CN9.5 CN9.6 44.88,9.44 43.56,8.13 39.37,8.13 38.99,8.51 38.99,13.1 D7.1 40.11,14.33 41.02,15.23 CN9.3 ; R11.2 29.49,37.38 28.5,37.38 ; 17.35,17.4 17.35,17.7 v1(15.88,19.18) U6.2 ; X1.4 21.88,45.03 CN12.1 ; X1.4 18.68,43.5 C4.1 16.93,43.3 16.83,43.4 ; CN5.3 2.62,23.86 CN5.4 2.62,28.81 CN6.3 CN7.3 2.62,36.4 CN7.4 CN8.4 2.62,49.1 4.7,51.18 10.03,51.18 11.3,49.91 11.3,46.23 12.19,45.34 13.95,45.34 IIC1.2 14.89,45.34 16.83,43.4 ; 8.81,17.78 C26.2 ; 33.78,20.07 33.78,22.49 34.15,22.86 U7.8 ; R12.2 30.94,26.5 C1.1 33.29,24.76 U7.8 ; 29.3,3.39 CN10.1
  Top Layer w0.508: 28.07,1.91 35.78,1.91 39.08,5.21 ; 29.3,3.39 27.69,1.78 12.04,1.78 CN13.1 ; C11.1 29.3,6.57 CN10.1
  Bottom Layer w0.254: v1(24.89,22.86) 24.89,21.46 v1(21.59,18.16) ; v1(15.88,19.18) 12.41,22.65 v1(12.41,23.13) ; 14.59,34.95 14.9,35.27 C32.2 14.9,37.34 ; v1(23.88,40.77) 20.07,44.58 v1(19.05,44.58) ; v1(18.92,37.08) 18.92,36.6 19.13,36.39 19.13,34.95
  Bottom Layer w0.508: CN13.1 3.81,10 3.81,47.12 8.37,51.67 19.7,51.67 21.46,49.91 CN12.1
VCC: length 146.7
  Top Layer w0.254: v1(17.27,37.46) 17.27,37.59 16.96,37.91 U1.21 ; 21.96,34.83 21.96,37.04 ; 21.96,34.83 24.46,37.33 U1.6 24.46,40.45 C27.2 28.17,41.8 ; 21.96,34.83 v1(20.4,33.27) 17.86,35.81 15.4,35.81 14.33,36.88 U1.28 11.03,36.88 10.78,37.13 10.78,41.51 12.06,42.8 IIC1.1 ; 21.96,37.04 21.15,37.85 18.41,37.85 17.96,38.31 U1.19 17.96,40.87 C30.2 ; 21.96,37.04 U1.11 ; C22.2 13.41,24.89 U1.50 14.19,25.88 15.11,26.8 15.11,28.07 16,28.96 v1(17.78,28.96) ; 34.29,26.42 36.83,26.42 ; U8.1 34.5,47 C24.2 29.3,41.8 28.17,41.8 ; v1(28.83,12.7) 30.19,12.7 D4.1 ; LED1.2 18.95,19.13 v1(20.7,20.88) U3.4 ; U3.4 24.33,18.62 v1(24.26,18.54) ; U3.4 26.21,20.88 26.92,21.59 26.92,24.3 U1.75 ; v1(16,37.46) 16.46,37.92 U1.22 ; 28.17,41.8 28.17,40.07 C23.2 29.2,38.58 28.5,37.88
  Bottom Layer w0.254: 17.74,30.14 17.74,29 v1(17.78,28.96) ; 17.74,30.14 15.99,31.89 15.99,34.95 15.99,34.96 15.99,36.7 16,36.71 v1(16,37.46) ; 17.74,30.14 17.74,30.61 ; 17.74,30.61 v1(20.4,33.27) ; 17.74,30.61 C28.1 17.74,37 v1(17.27,37.46) ; v1(20.7,20.88) 17.78,23.8 v1(17.78,28.96) ; v1(24.26,18.54) 24.26,17.27 v1(28.83,12.7) ; v1(17.78,28.96) 31.75,28.96 34.29,26.42
VIN: length 129.4
  Top Layer w0.254: U2.5 17.22,10.29 R4.2
  Top Layer w0.508: v1(23.22,8.13) 24.27,8.13 24.52,7.87 ; 24.52,7.87 C11.2 ; 24.52,7.87 24.52,3.95 CN10.2 ; U2.5 v1(20.06,10.29)
  Bottom Layer w0.508: v1(20.06,10.29) 21.06,10.29 v1(23.22,8.13) ; CN12.2 24.34,52.45 5.59,52.45 1.78,48.64 1.78,7.04 CN13.2 6.66,2.16 22.22,2.16 23.8,3.73 CN10.2 25.99,2.03 40.51,2.03 43.69,5.21 44.08,5.21
BOOT0: length 6.1
  Top Layer w0.254: 28.5,34.88 30.83,34.88 R12.1 33.55,34.78 S_BOOT1.1
BOOT1: length 31.4
  Top Layer w0.254: U1.37 v1(26.15,32.38) 26.16,32.38 ; S_BOOT1.2 33.55,37.32 R11.1
  Bottom Layer w0.254: v1(26.15,32.38) 35.17,32.38 S_BOOT1.2
BST: length 5.7
  Top Layer w0.254: U2.1 19.76,7.31 C13.1
CAN1_H: length 45
  Top Layer w0.254: CN1.2 41.95,28.23 41.28,27.56 ; 41.28,33.39 42.39,34.5 CN2.2 ; 41.28,33.39 41.28,39.65 ; 41.28,33.39 41.28,27.56 ; CN3.2 42.39,40.77 41.28,39.65 ; 41.28,45.92 42.39,47.04 CN4.2 ; 41.28,45.92 41.28,39.65 ; 41.28,45.92 41.28,47.88 41.87,48.47 41.87,48.81 41.33,49.35 41.33,49.71 41.63,50.01 41.95,50.01 R16.2 ; U7.7 35.88,22.28 C19.1 41.27,22.28 41.3,22.31 42.04,22.31 42.42,22.69 42.42,23.71 41.28,24.85 41.28,27.56
CAN1_L: length 45.2
  Top Layer w0.254: 43.94,26.16 43.12,26.98 CN1.1 ; 43.94,26.16 43.94,22.68 41.84,20.58 C18.1 37.02,20.32 35.2,20.32 ; 43.94,26.16 43.94,32.38 ; 43.94,45.08 43.94,50.6 R16.1 ; 43.94,45.08 43.24,45.79 CN4.1 ; 43.94,45.08 43.94,43.39 43.43,42.89 43.43,42.16 43.47,42.16 43.94,41.69 43.94,38.73 ; CN3.1 43.16,39.52 43.94,38.73 ; 43.94,38.73 43.94,37.08 43.56,36.7 43.56,35.61 43.94,35.23 43.94,32.38 ; 43.94,32.38 43.07,33.25 CN2.1
CAN1_RX: length 13.8
  Top Layer w0.254: U1.70 24.46,25.08 23.38,26.16 v1(22.86,26.16) ; v1(28.07,19.05) U7.4
  Bottom Layer w0.254: v1(22.86,26.16) 26.92,22.1 26.92,20.19 v1(28.07,19.05)
CAN1_TX: length 8.9
  Top Layer w0.254: v1(24.51,26.29) 24.96,25.84 U1.71 ; v1(28.07,22.86) U7.1
  Bottom Layer w0.254: v1(24.51,26.29) 27.94,22.86 v1(28.07,22.86)
CAN1_VREF: length 12
  Top Layer w0.254: 30.66,15.86 32.53,15.86 ; 32.53,15.86 C14.1 34.15,15.81 ; 32.53,15.86 31.75,16.64 31.75,18.29 32.51,19.05 U7.5 ; 36.07,15.86 36.02,15.81 34.15,15.81 ; 34.15,15.81 C15.1
CAN2_H: length 44.7
  Top Layer w0.254: U6.7 8.28,19.18 6.85,17.75 6.16,17.75 5.89,18.02 R17.2 3.94,18.79 3.94,21.72 4.45,22.22 4.45,25.15 ; 4.45,43.81 4.45,48.96 R13.1 ; 4.45,43.81 4.45,37.34 ; 4.45,43.81 5.14,44.51 CN8.2 ; 4.45,31.11 4.45,29.59 4.83,29.21 4.83,28.57 4.45,28.19 4.45,25.15 ; 4.45,31.11 5.31,31.98 CN6.2 ; 4.45,31.11 4.45,33.64 4.7,33.89 4.7,34.42 4.45,34.67 4.45,37.34 ; 4.45,25.15 5.01,25.71 CN5.2 ; 4.45,37.34 5.35,38.24 CN7.2
CAN2_L: length 44.7
  Top Layer w0.254: 7.24,44.71 7.24,45.59 7.75,46.1 7.75,46.61 5.97,48.39 5.97,48.97 R13.2 ; 7.24,44.71 6.35,45.59 5.99,45.59 CN8.1 ; 7.24,44.71 7.24,38.44 ; 7.24,38.44 7.24,32.17 ; 7.24,38.44 6.31,39.37 5.95,39.37 CN7.1 ; 7.24,25.9 7.24,23.75 4.71,21.22 R17.1 6.22,19.53 6.39,19.7 ; 7.24,25.9 6.18,26.96 CN5.1 ; 7.24,25.9 7.24,32.17 ; CN6.1 6.18,33.23 7.24,32.17 ; 6.22,19.43 6.84,19.43 7.86,20.45 U6.6
CAN2_RX: length 9.1
  Top Layer w0.254: U1.51 14.96,25.81 15.88,26.73 v1(15.88,27.05) ; U6.4 14.48,21.86 v1(14.48,22.48)
  Bottom Layer w0.254: v1(15.88,27.05) 15.49,26.67 15.49,23.49 v1(14.48,22.48)
CAN2_TX: length 12.8
  Top Layer w0.254: v1(15.75,17.91) U6.1 ; v1(16.26,26.29) 15.46,25.49 U1.52
  Bottom Layer w0.254: v1(15.75,17.91) 16.89,19.05 16.89,25.65 v1(16.26,26.29)
CAN2_VREF: length 9.3
  Top Layer w0.254: U6.5 8.51,22.14 C17.1 ; C17.1 8.34,23.41 7.75,24 7.75,25.92 R7.2 10.18,26.68 R8.1 ; C17.1 9.97,23.41 C16.1
CLK: length 3.7
  Top Layer w0.254: R14.2 39.99,12.81 41.16,13.98 CN9.2
DIO: length 4.5
  Top Layer w0.254: R15.2 40.74,9.49 41.98,10.73 CN9.1
EN: length 2.5
  Top Layer w0.254: R4.1 18.28,12.06 U2.4
FB: length 4.4
  Top Layer w0.254: R2.1 23.22,10.69 22.67,11.24 U2.3
I2C1_SCL: length 23.8
  Top Layer w0.254: v1(26.29,33.27) 26.89,33.88 28.5,33.88
  Bottom Layer w0.254: v1(26.29,33.27) 24.89,33.27 15.88,42.29 15.88,46.74 13.97,48.64
I2C1_SDA: length 24.1
  Top Layer w0.254: 28.5,34.38 v1(26.29,34.38)
  Bottom Layer w0.254: 13.97,51.18 16.89,48.26 16.89,43.77 v1(26.29,34.38)
LX: length 11.9
  Top Layer w0.254: L1.1 15.5,8.71 ; 15.5,8.71 C13.2 18.47,8.71 U2.6 ; 15.5,8.71 15.06,8.27 D8.1
OSC-IN: length 6.4
  Top Layer w0.254: C3.2 24.03,43.5 X1.3 21.46,42.4 U1.12
OSC-OUT: length 4.7
  Top Layer w0.254: U1.13 20.96,41.21 X1.1 19.95,42.21 C4.2
SWCLK: length 26.6
  Top Layer w0.254: R14.1 36.54,10.16 v1(36.07,10.16) ; v1(26.29,27.18) 26.29,26.67 27.08,25.88 27.5,25.88 27.51,25.88 28.5,25.88
  Bottom Layer w0.254: v1(36.07,10.16) 36.07,17.4 v1(26.29,27.18)
SWDIO: length 27.9
  Top Layer w0.254: v1(25.53,26.92) 25.46,26.85 U1.72 ; v1(36.07,8.38) 36.88,8.38 R15.1
  Bottom Layer w0.254: v1(36.07,8.38) 35.43,9.02 35.43,17.02 v1(25.53,26.92)
UART1_RX: length 43.8
  Top Layer w0.254: v1(38.23,46.35) 38.23,47.91 U8.4 ; U1.68 23.46,23.45 v1(22.99,22.99) ; v1(20.83,26.03) 20.83,29.08 v1(21.59,29.84)
  Bottom Layer w0.254: v1(22.99,22.99) 22.99,23.88 v1(20.83,26.03) ; v1(38.23,46.35) 39.12,45.47 39.12,32.89 36.07,29.84 v1(21.59,29.84)
UART1_TX: length 41.9
  Top Layer w0.254: U8.3 37,46.4 v1(36.96,46.35) ; v1(21.84,26.03) 21.84,28.96 v1(23.5,30.61) ; U1.69 v1(23.96,22.99)
  Bottom Layer w0.254: v1(36.96,46.35) 38.35,44.96 38.35,33.02 35.94,30.61 v1(23.5,30.61) ; v1(21.84,26.03) 23.96,23.92 v1(23.96,22.99)
VCAP_1: length 2.6
  Top Layer w0.254: U1.49 12.49,26.38 12.32,26.54 12.32,27.08 C2.2
VCAP_2: length 3.5
  Top Layer w0.254: U1.73 25.96,25.25 26.23,25.53 27.35,25.53 C1.2

## Copper pours and planes (outline as drawn; the poured copper is in the pictures)
GND on Top Layer: 0,53.72 48.13,53.72 48.13,0 0,0
GND on Top Layer: 0.26,53.72 48.13,53.72 48.13,0 0.26,0
GND on Bottom Layer: 0,53.72 48.13,53.72 48.13,0 0,0
